# Altium schematic sheet Sheet1 - 副本.SchDoc
size A3
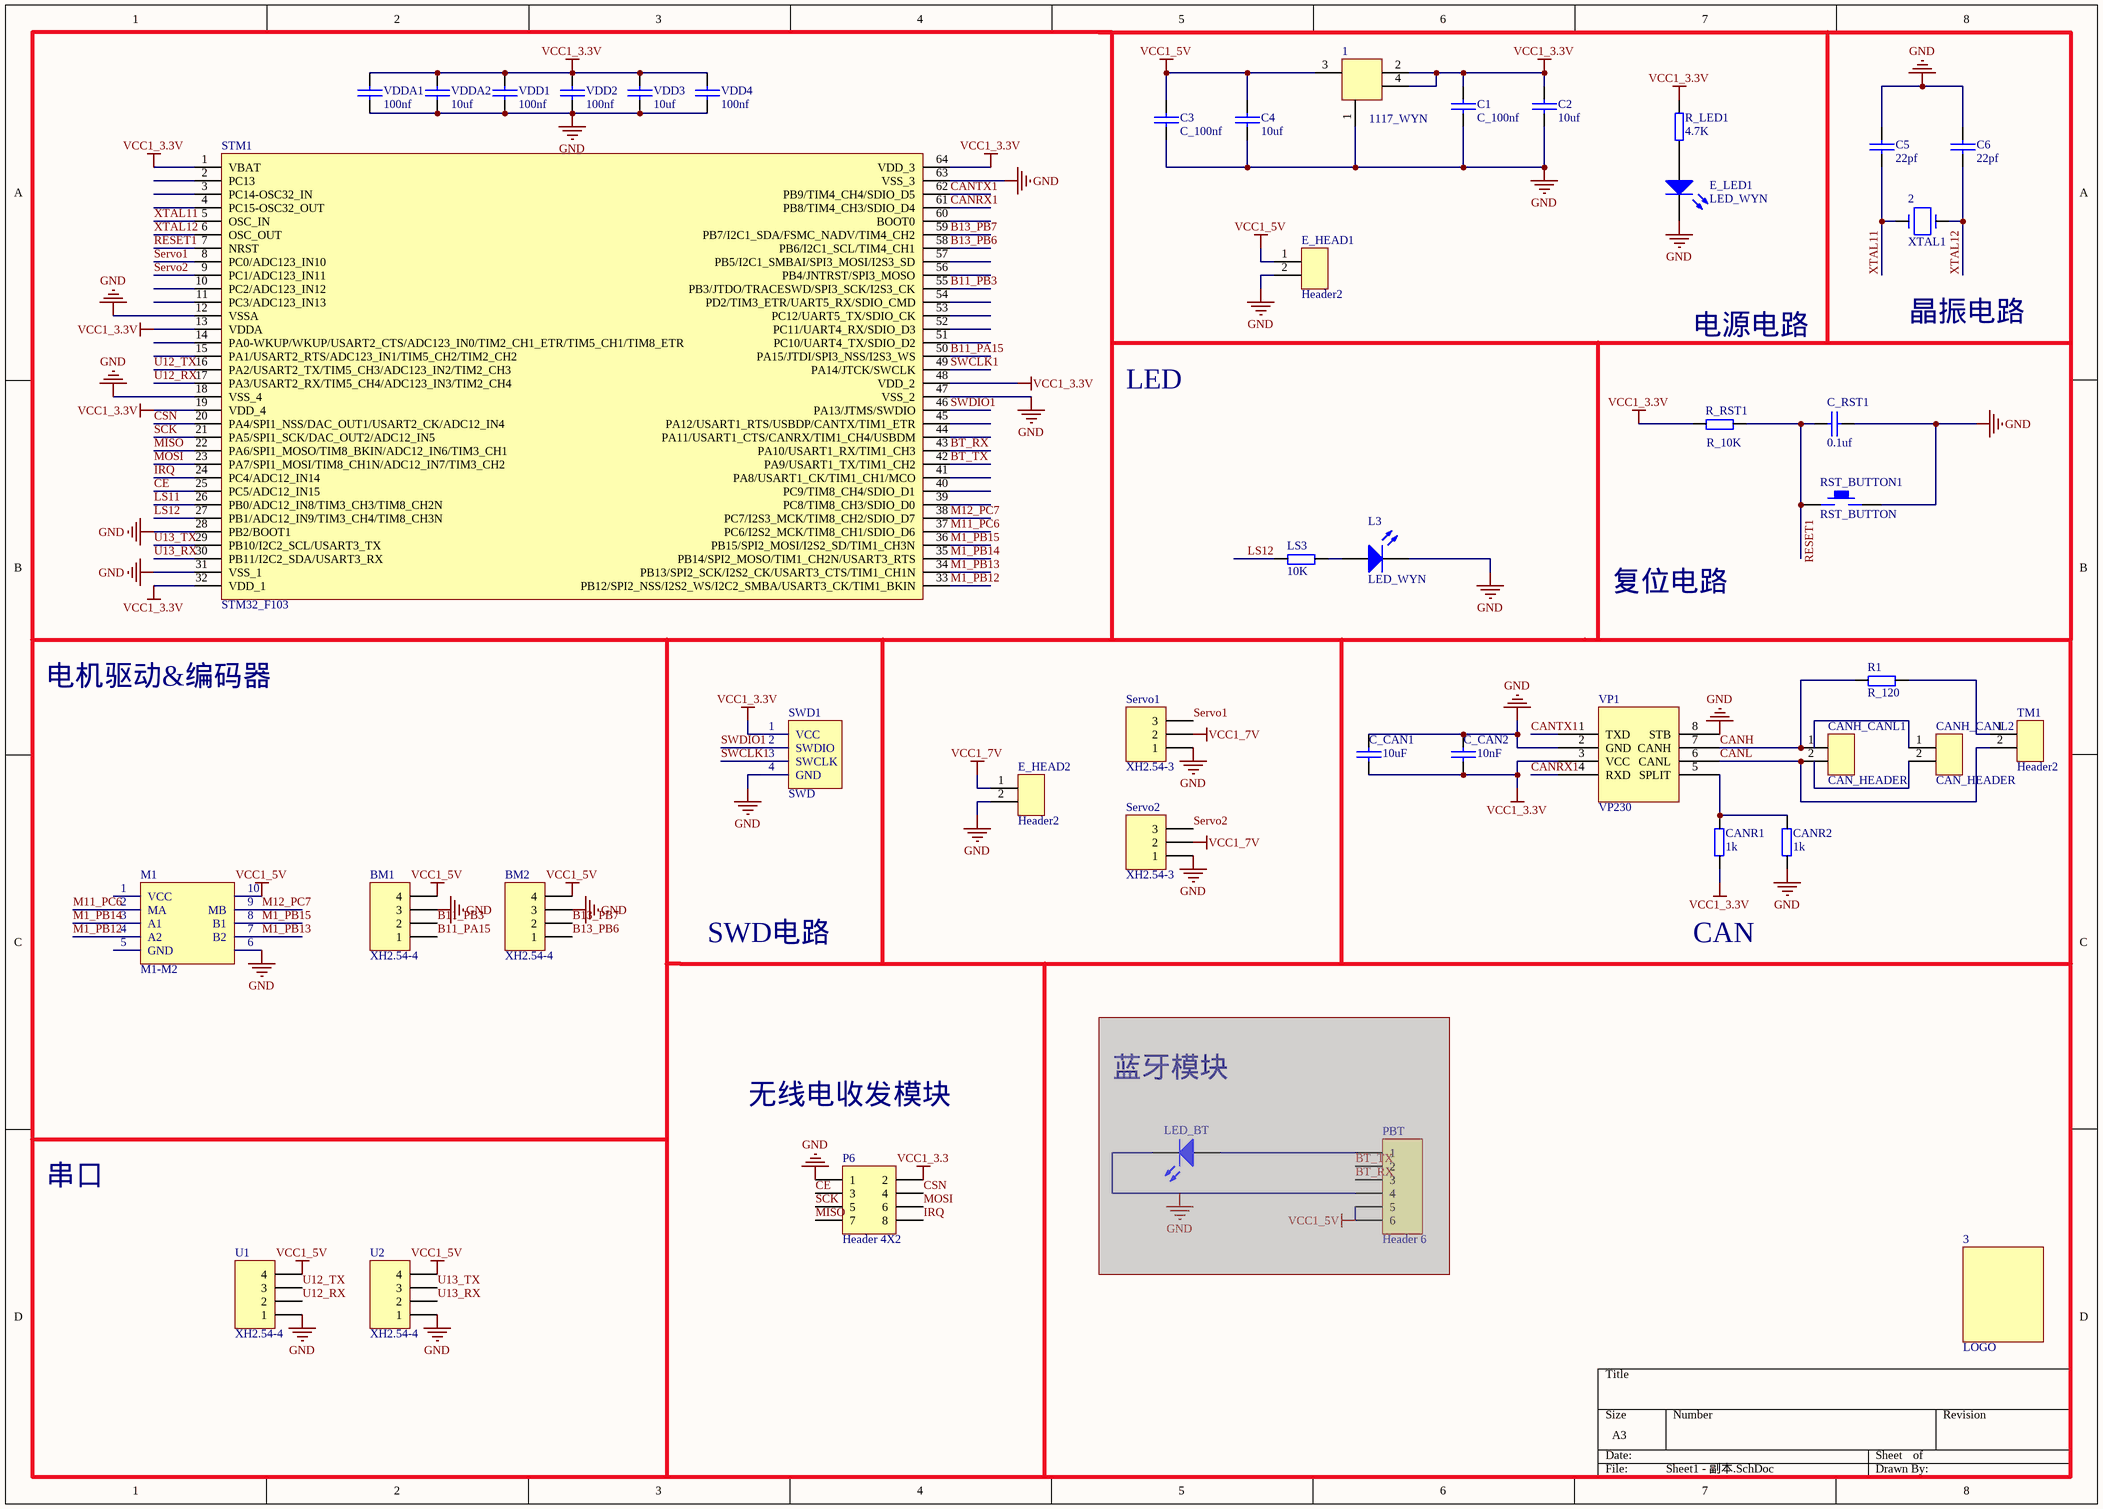
[diagram p0: Sheet1 - 副本.SchDoc]

## Parts
1  1117_WYN  [SOT223_M]
2  XTAL1  [XTAL_D]
3  LOGO  [LOGO]
BM1  XH2.54-4  [XH2.54-4]
BM2  XH2.54-4  [XH2.54-4]
C1  C_100nf  [0603]
C2  10uf  [0603]
C3  C_100nf  [0603]
C4  10uf  [0603]
C5  22pf  [0603]
C6  22pf  [0603]
C_CAN1  10uF  [0603]
C_CAN2  10nF  [0603]
C_RST1  0.1uf  [0603]
CANH_CANL1  CAN_HEADER  [CAN信号]
CANH_CANL2  CAN_HEADER  [CAN信号]
CANR1  1k  [0603_WYH]
CANR2  1k  [0603_WYH]
E_HEAD1  Header2  [Power]
E_HEAD2  Header2  [Power]
E_LED1  LED_WYN  [0603]
L3  LED_WYN  [0603]
LED_BT  (no value)  [3.2X1.6X1.1]  (masked out: inside a compile mask, not in the netlist)
LS3  10K  [0603_WYH]
M1  M1-M2  [MHDR2X5]
P6  Header 4X2  [HDR2X4]
PBT  Header 6  [HDR1X6]  (masked out: inside a compile mask, not in the netlist)
R1  R_120  [0603_WYH]
R_LED1  4.7K  [0603]
R_RST1  R_10K  [0603_WYH]
RST_BUTTON1  RST_BUTTON  [CLCK]
Servo1  XH2.54-3  [XH2.54-3]
Servo2  XH2.54-3  [XH2.54-3]
STM1  STM32_F103  [STM32TSQFP50P1200X1200X160-64N]
SWD1  SWD  [HDR1X5]
TM1  Header2  [HDR1X2]
U1  XH2.54-4  [XH2.54-4]
U2  XH2.54-4  [XH2.54-4]
VDD1  100nf  [0603]
VDD2  100nf  [0603_WYH]
VDD3  10uf  [0603]
VDD4  100nf  [0603_WYH]
VDDA1  100nf  [0603]
VDDA2  10uf  [0603]
VP1  VP230  [VP230]

## Nets
GND: 1.1 BM1.3 BM2.3 C1.2 C2.2 C3.2 C4.2 C5.1 C6.1 C_CAN1.1 C_CAN2.1 C_RST1.2 CANR2.2 E_HEAD1.2 E_HEAD2.2 E_LED1.2(K) L3.2(K) M1.6 P6.1 RST_BUTTON1.2 Servo1.1 Servo2.1 STM1.12(VSSA) STM1.18(VSS_4) STM1.28(PB2/BOOT1) STM1.31(VSS_1) STM1.47(VSS_2) STM1.63(VSS_3) SWD1.4(GND) U1.1 U2.1 VDD1.2 VDD2.2 VDD3.2 VDD4.2 VDDA1.2 VDDA2.2 VP1.2(GND) VP1.8(STB)
VCC1_3.3: P6.2
VCC1_3.3V: 1.2 1.4 C1.1 C2.1 C_CAN1.2 C_CAN2.2 CANR1.2 R_LED1.2 R_RST1.1 STM1.1(VBAT) STM1.13(VDDA) STM1.19(VDD_4) STM1.32(VDD_1) STM1.48(VDD_2) STM1.64(VDD_3) SWD1.1(VCC) VDD1.1 VDD2.1 VDD3.1 VDD4.1 VDDA1.1 VDDA2.1 VP1.3(VCC)
VCC1_5V: 1.3 BM1.4 BM2.4 C3.1 C4.1 E_HEAD1.1 M1.10 U1.4 U2.4
VCC1_7V: E_HEAD2.1 Servo1.2 Servo2.2
B11_PA15: BM1.1 STM1.50(PA15/JTDI/SPI3_NSS/I2S3_WS)
B11_PB3: BM1.2 STM1.55(PB3/JTDO/TRACESWD/SPI3_SCK/I2S3_CK)
B13_PB6: BM2.1 STM1.58(PB6/I2C1_SCL/TIM4_CH1)
B13_PB7: BM2.2 STM1.59(PB7/I2C1_SDA/FSMC_NADV/TIM4_CH2)
BT_RX: STM1.43(PA10/USART1_RX/TIM1_CH3)
BT_TX: STM1.42(PA9/USART1_TX/TIM1_CH2)
CANH: CANH_CANL1.1 R1.1 VP1.7(CANH)
CANL: CANH_CANL1.2 TM1.2 VP1.6(CANL)
CANRX1: STM1.61(PB8/TIM4_CH3/SDIO_D4) VP1.4(RXD)
CANTX1: STM1.62(PB9/TIM4_CH4/SDIO_D5) VP1.1(TXD)
CE: P6.3 STM1.25(PC5/ADC12_IN15)
CSN: P6.4 STM1.20(PA4/SPI1_NSS/DAC_OUT1/USART2_CK/ADC12_IN4)
IRQ: P6.8 STM1.24(PC4/ADC12_IN14)
LS11: STM1.26(PB0/ADC12_IN8/TIM3_CH3/TIM8_CH2N)
LS12: LS3.1 STM1.27(PB1/ADC12_IN9/TIM3_CH4/TIM8_CH3N)
M1_PB12: M1.4(A2) STM1.33(PB12/SPI2_NSS/I2S2_WS/I2C2_SMBA/USART3_CK/TIM1_BKIN)
M1_PB13: M1.7(B2) STM1.34(PB13/SPI2_SCK/I2S2_CK/USART3_CTS/TIM1_CH1N)
M1_PB14: M1.3(A1) STM1.35(PB14/SPI2_MOSO/TIM1_CH2N/USART3_RTS)
M1_PB15: M1.8(B1) STM1.36(PB15/SPI2_MOSI/I2S2_SD/TIM1_CH3N)
M11_PC6: M1.2(MA) STM1.37(PC6/I2S2_MCK/TIM8_CH1/SDIO_D6)
M12_PC7: M1.9(MB) STM1.38(PC7/I2S3_MCK/TIM8_CH2/SDIO_D7)
MISO: P6.7 STM1.22(PA6/SPI1_MOSO/TIM8_BKIN/ADC12_IN6/TIM3_CH1)
MOSI: P6.6 STM1.23(PA7/SPI1_MOSI/TIM8_CH1N/ADC12_IN7/TIM3_CH2)
RESET1: C_RST1.1 R_RST1.2 RST_BUTTON1.1 STM1.7(NRST)
SCK: P6.5 STM1.21(PA5/SPI1_SCK/DAC_OUT2/ADC12_IN5)
Servo1: Servo1.3 STM1.8(PC0/ADC123_IN10)
Servo2: Servo2.3 STM1.9(PC1/ADC123_IN11)
SWCLK1: STM1.49(PA14/JTCK/SWCLK) SWD1.3(SWCLK)
SWDIO1: STM1.46(PA13/JTMS/SWDIO) SWD1.2(SWDIO)
U12_RX: STM1.17(PA3/USART2_RX/TIM5_CH4/ADC123_IN3/TIM2_CH4) U1.2
U12_TX: STM1.16(PA2/USART2_TX/TIM5_CH3/ADC123_IN2/TIM2_CH3) U1.3
U13_RX: STM1.30(PB11/I2C2_SDA/USART3_RX) U2.2
U13_TX: STM1.29(PB10/I2C2_SCL/USART3_TX) U2.3
XTAL11: 2.1 C5.2 STM1.5(OSC_IN)
XTAL12: 2.2 C6.2 STM1.6(OSC_OUT)
NetCANR1_1: CANR1.1 CANR2.1 VP1.5(SPLIT)
NetE_LED1_1: E_LED1.1(A) R_LED1.1
NetL3_1: L3.1(A) LS3.2
NetR1_2: R1.2 TM1.1

Not connected (* = marked no-connect by the designer): CANH_CANL2 1 2; M1 1(VCC) 5(GND); STM1 2(PC13) 3(PC14-OSC32_IN) 4(PC15-OSC32_OUT) 10(PC2/ADC123_IN12) 11(PC3/ADC123_IN13) 14(PA0-WKUP/WKUP/USART2_CTS/ADC123_IN0/TIM2_CH1_ETR/TIM5_CH1/TIM8_ETR) 15(PA1/USART2_RTS/ADC123_IN1/TIM5_CH2/TIM2_CH2) 39(PC8/TIM8_CH3/SDIO_D0) 40(PC9/TIM8_CH4/SDIO_D1) 41(PA8/USART1_CK/TIM1_CH1/MCO) 44(PA11/USART1_CTS/CANRX/TIM1_CH4/USBDM) 45(PA12/USART1_RTS/USBDP/CANTX/TIM1_ETR) 51(PC10/UART4_TX/SDIO_D2) 52(PC11/UART4_RX/SDIO_D3) 53(PC12/UART5_TX/SDIO_CK) 54(PD2/TIM3_ETR/UART5_RX/SDIO_CMD) 56(PB4/JNTRST/SPI3_MOSO) 57(PB5/I2C1_SMBAI/SPI3_MOSI/I2S3_SD) 60(BOOT0)

## Notes on the sheet
- 电源电路
- 晶振电路
- LED
- 复位电路
- 电机驱动&编码器
- SWD电路
- CAN
- 无线电收发模块
- 蓝牙模块
- 串口

## Library data of the parts
2 = XTAL
C1-C6 C_CAN1 C_CAN2 C_RST1 VDD1-VDD4 VDDA1 VDDA2 = CAP_WYN
CANR1 CANR2 LS3 R1 R_RST1 = R
LED_BT = LED2: Typical RED, GREEN, YELLOW, AMBER GaAs LED; Published: 8-Jun-2000; LatestRevisionDate: 17-Jul-2002; LatestRevisionNote: Re-released for DXP Platform.; PackageVersion: Feb-2002; PackageReference: 3.2X1.6X1.1; Publisher: Altium Limited; PackageDescription: SM LED; 2 Flat Leads
M1 = 电机接口
P6 = Header 4X2: Header, 4-Pin, Dual row; LatestRevisionDate: 17-Jul-2002; LatestRevisionNote: Re-released for DXP Platform.; Publisher: Altium Limited
PBT = Header 6: Header, 6-Pin; LatestRevisionDate: 17-Jul-2002; LatestRevisionNote: Re-released for DXP Platform.; Publisher: Altium Limited
R_LED1 = RES_WYN